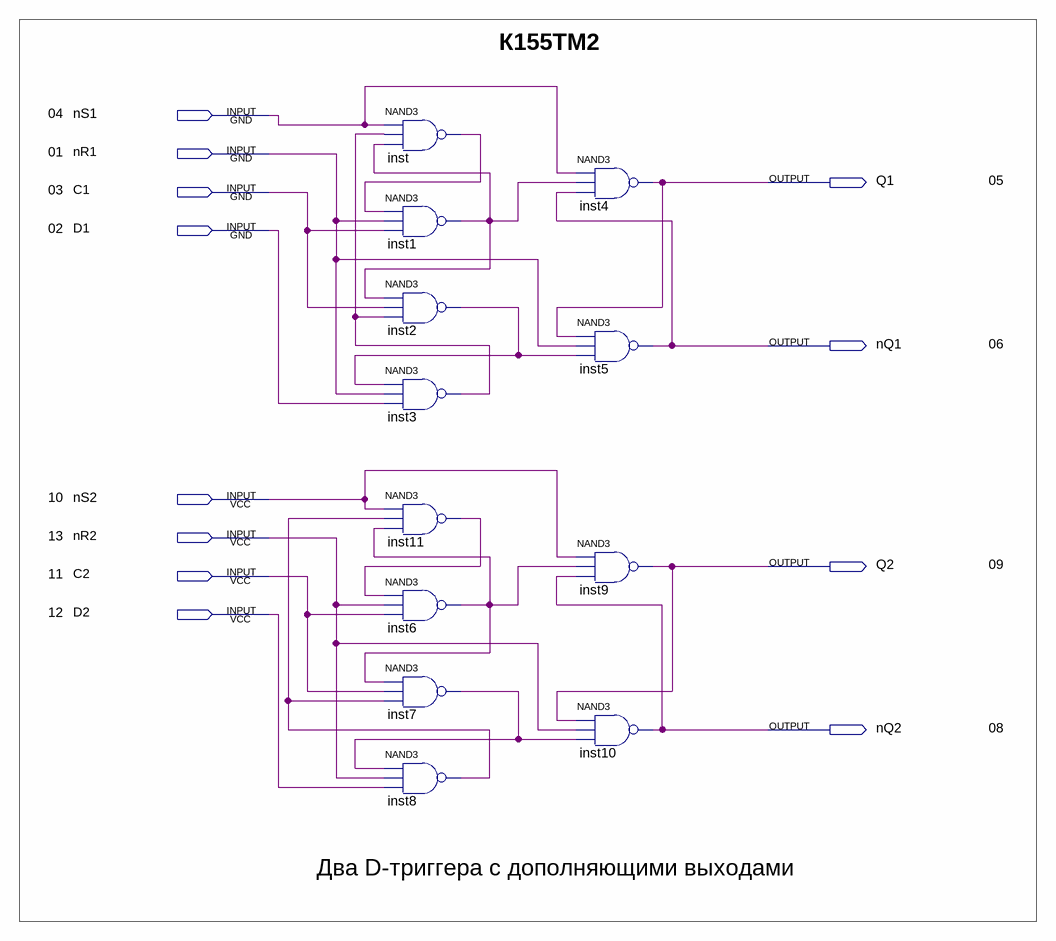
[diagram p0: schematic sheet]
// Quartus schematic K155TM2.bdf as structural Verilog: 12 symbols, 12 pins
module K155TM2 (
  input  nS1,
  input  nR1,
  input  C1,
  input  D1,
  input  nS2,
  input  nR2,
  input  C2,
  input  D2,
  output Q1,
  output nQ1,
  output Q2,
  output nQ2
);

  wire inst1_out, inst2_out, inst3_out, inst6_out, inst7_out, inst8_out, inst11_out, inst_out;

  nand inst (inst_out, nS1, inst3_out, inst1_out);
  nand inst1 (inst1_out, inst_out, nR1, C1);
  nand inst2 (inst2_out, inst1_out, C1, inst3_out);
  nand inst3 (inst3_out, inst2_out, nR1, D1);
  nand inst11 (inst11_out, nS2, inst8_out, inst6_out);
  nand inst6 (inst6_out, inst11_out, nR2, C2);
  nand inst7 (inst7_out, inst6_out, C2, inst8_out);
  nand inst8 (inst8_out, inst7_out, nR2, D2);
  nand inst4 (Q1, nS1, inst1_out, nQ1);
  nand inst5 (nQ1, Q1, nR1, inst2_out);
  nand inst9 (Q2, nS2, inst6_out, nQ2);
  nand inst10 (nQ2, Q2, nR2, inst7_out);

  // Notes on the sheet:
  //   К155ТМ2
  //   04
  //   01
  //   05
  //   03
  //   02
  //   06
  //   10
  //   13
  //   09
  //   11
  //   12
  //   08
  //   Два D-триггера с дополняющими выходами
endmodule
